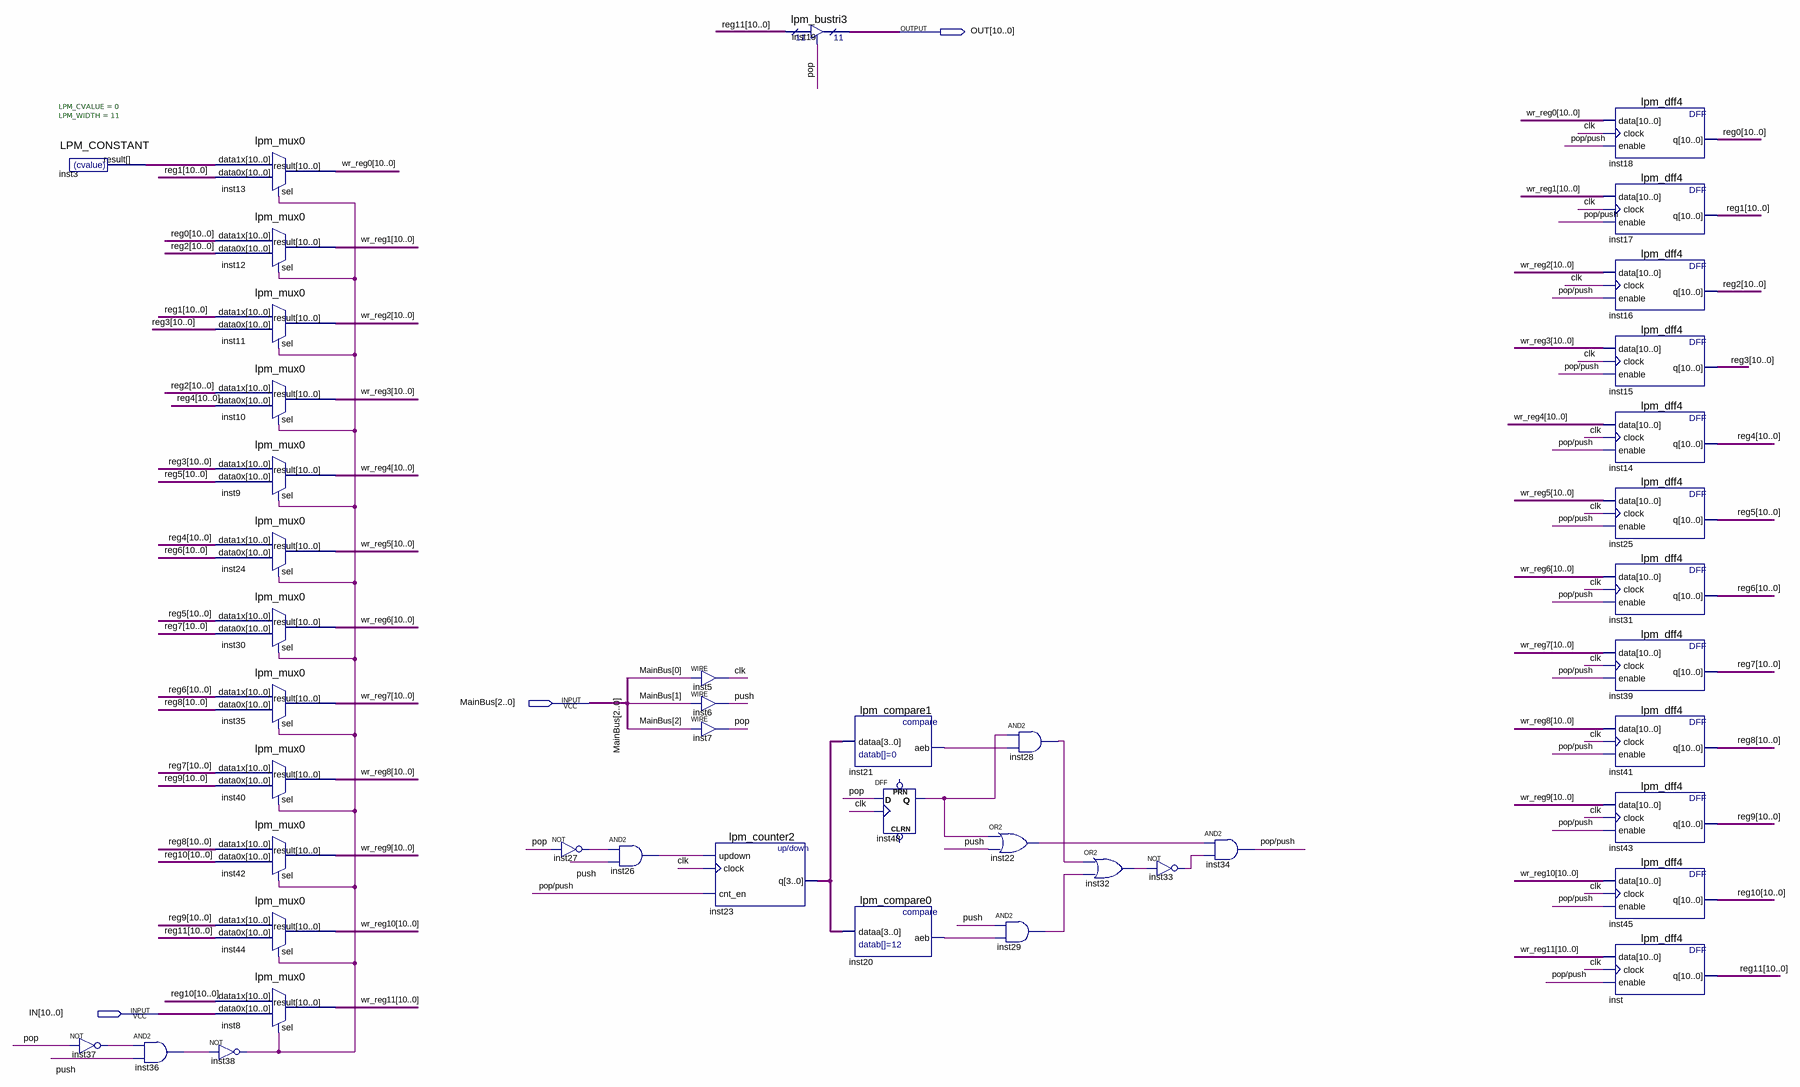
[diagram p0: schematic sheet]
// Quartus schematic Stack.bdf as structural Verilog: 44 symbols, 3 pins
module Stack (
  input  [2:0] MainBus,
  input  [10:0] IN,
  output [10:0] OUT
);

  wire clk, inst20_aeb, inst21_aeb, inst22_out, inst26_out, inst27_out, inst28_out, inst29_out, inst32_out,
       inst33_out, inst36_out, inst37_out, inst38_out, inst48_q, pop, \pop/push , push;
  wire [3:0] inst23_q;
  wire [10:0] inst3_result, reg0, reg1, reg2, reg3, reg4, reg5, reg6, reg7, reg8, reg9, reg10, reg11,
       wr_reg0, wr_reg1, wr_reg2, wr_reg3, wr_reg4, wr_reg5, wr_reg6, wr_reg7, wr_reg8, wr_reg9, wr_reg10,
       wr_reg11;

  LPM_CONSTANT #(.LPM_CVALUE(0), .LPM_WIDTH(11)) inst3 (.result(inst3_result));
  not inst37 (inst37_out, pop);
  and inst36 (inst36_out, inst37_out, push);
  lpm_mux0 inst13 (.data1x(inst3_result), .data0x(reg1), .sel(inst38_out), .result(wr_reg0));
  lpm_mux0 inst12 (.data1x(reg0), .data0x(reg2), .sel(inst38_out), .result(wr_reg1));
  lpm_mux0 inst11 (.data1x(reg1), .data0x(reg3), .sel(inst38_out), .result(wr_reg2));
  lpm_mux0 inst10 (.data1x(reg2), .data0x(reg4), .sel(inst38_out), .result(wr_reg3));
  lpm_mux0 inst9 (.data1x(reg3), .data0x(reg5), .sel(inst38_out), .result(wr_reg4));
  lpm_mux0 inst24 (.data1x(reg4), .data0x(reg6), .sel(inst38_out), .result(wr_reg5));
  lpm_mux0 inst30 (.data1x(reg5), .data0x(reg7), .sel(inst38_out), .result(wr_reg6));
  lpm_mux0 inst35 (.data1x(reg6), .data0x(reg8), .sel(inst38_out), .result(wr_reg7));
  lpm_mux0 inst40 (.data1x(reg7), .data0x(reg9), .sel(inst38_out), .result(wr_reg8));
  lpm_mux0 inst42 (.data1x(reg8), .data0x(reg10), .sel(inst38_out), .result(wr_reg9));
  lpm_mux0 inst44 (.data1x(reg9), .data0x(reg11), .sel(inst38_out), .result(wr_reg10));
  lpm_mux0 inst8 (.data1x(reg10), .data0x(IN), .sel(inst38_out), .result(wr_reg11));
  not inst38 (inst38_out, inst36_out);
  not inst27 (inst27_out, pop);
  and inst26 (inst26_out, inst27_out, push);
  assign clk = MainBus[0];  // WIRE inst5
  assign push = MainBus[1];  // WIRE inst6
  assign pop = MainBus[2];  // WIRE inst7
  lpm_counter2 inst23 (.updown(inst26_out), .clock(clk), .cnt_en(\pop/push ), .q(inst23_q));
  lpm_bustri3 inst19 (.enabledt(pop), .data(reg11), .tridata(OUT));
  lpm_compare1 inst21 (.dataa(inst23_q), .aeb(inst21_aeb));
  lpm_compare0 inst20 (.dataa(inst23_q), .aeb(inst20_aeb));
  DFF inst48 (.CLK(clk), .D(pop), .Q(inst48_q));  // open: CLRN, PRN
  or inst22 (inst22_out, inst48_q, push);
  and inst29 (inst29_out, push, inst20_aeb);
  and inst28 (inst28_out, inst48_q, inst21_aeb);
  or inst32 (inst32_out, inst28_out, inst29_out);
  not inst33 (inst33_out, inst32_out);
  and inst34 (\pop/push , inst22_out, inst33_out);
  lpm_dff4 inst18 (.data(wr_reg0), .clock(clk), .enable(\pop/push ), .q(reg0));
  lpm_dff4 inst17 (.data(wr_reg1), .clock(clk), .enable(\pop/push ), .q(reg1));
  lpm_dff4 inst16 (.data(wr_reg2), .clock(clk), .enable(\pop/push ), .q(reg2));
  lpm_dff4 inst15 (.data(wr_reg3), .clock(clk), .enable(\pop/push ), .q(reg3));
  lpm_dff4 inst14 (.data(wr_reg4), .clock(clk), .enable(\pop/push ), .q(reg4));
  lpm_dff4 inst25 (.data(wr_reg5), .clock(clk), .enable(\pop/push ), .q(reg5));
  lpm_dff4 inst31 (.data(wr_reg6), .clock(clk), .enable(\pop/push ), .q(reg6));
  lpm_dff4 inst39 (.data(wr_reg7), .clock(clk), .enable(\pop/push ), .q(reg7));
  lpm_dff4 inst41 (.data(wr_reg8), .clock(clk), .enable(\pop/push ), .q(reg8));
  lpm_dff4 inst43 (.data(wr_reg9), .clock(clk), .enable(\pop/push ), .q(reg9));
  lpm_dff4 inst45 (.data(wr_reg10), .clock(clk), .enable(\pop/push ), .q(reg10));
  lpm_dff4 inst (.data(wr_reg11), .clock(clk), .enable(\pop/push ), .q(reg11));
endmodule
